# Altium schematic sheet Display.SchDoc
size A4; SheetNumber: 5; SheetTotal: 13
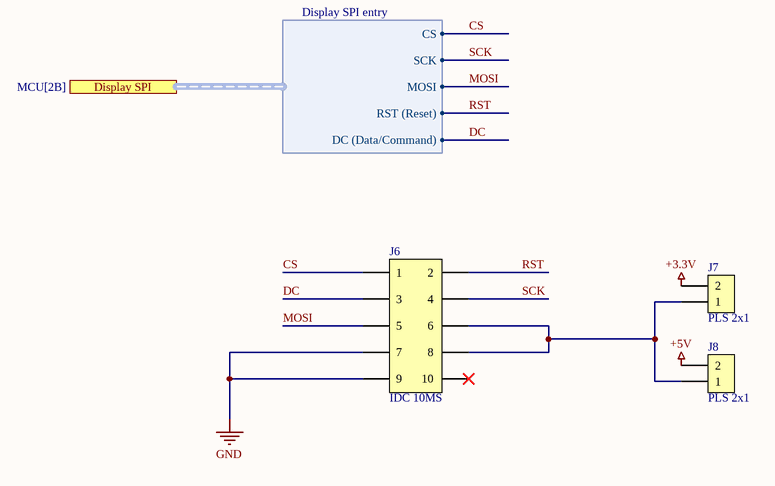
[diagram p0: Display.SchDoc]

## Parts
J6  IDC 10MS  [IDC 10MS]
J7  PLS 2x1  [PLS 2X1]
J8  PLS 2x1  [PLS 2X1]

## Ports
Display SPI (harness Display SPI entry, see MCU[2B])

## Harnesses
Display SPI entry: SCK, MOSI, RST (Reset), DC (Data/Command), CS

## Nets
+3.3V: J7.2
+5V: J8.2
GND: J6.7 J6.9
CS: J6.1 ; port Display SPI.CS
DC: J6.3 ; port Display SPI.DC (Data/Command)
MOSI: J6.5 ; port Display SPI.MOSI
RST: J6.2 ; port Display SPI.RST (Reset)
SCK: J6.4 ; port Display SPI.SCK
NetJ6_6: J6.6 J6.8 J7.1 J8.1

Not connected (* = marked no-connect by the designer): J6 10*

## Library data of the parts
J6 = Connector IDC 10MS: Type: Connector; ComponentLink1Description: Buy; ComponentLink1URL: https://radioremont.com/product/razem-bh-10-idc-10ms-s6-3/; ComponentLink2Description: Datasheet; ComponentLink2URL: https://static.chipdip.ru/lib/463/DOC002463525.pdf
J7 J8 = Conn 2 (PLS)